# EAGLE schematic EXCISS SEU (EAGLE 7.7.0)
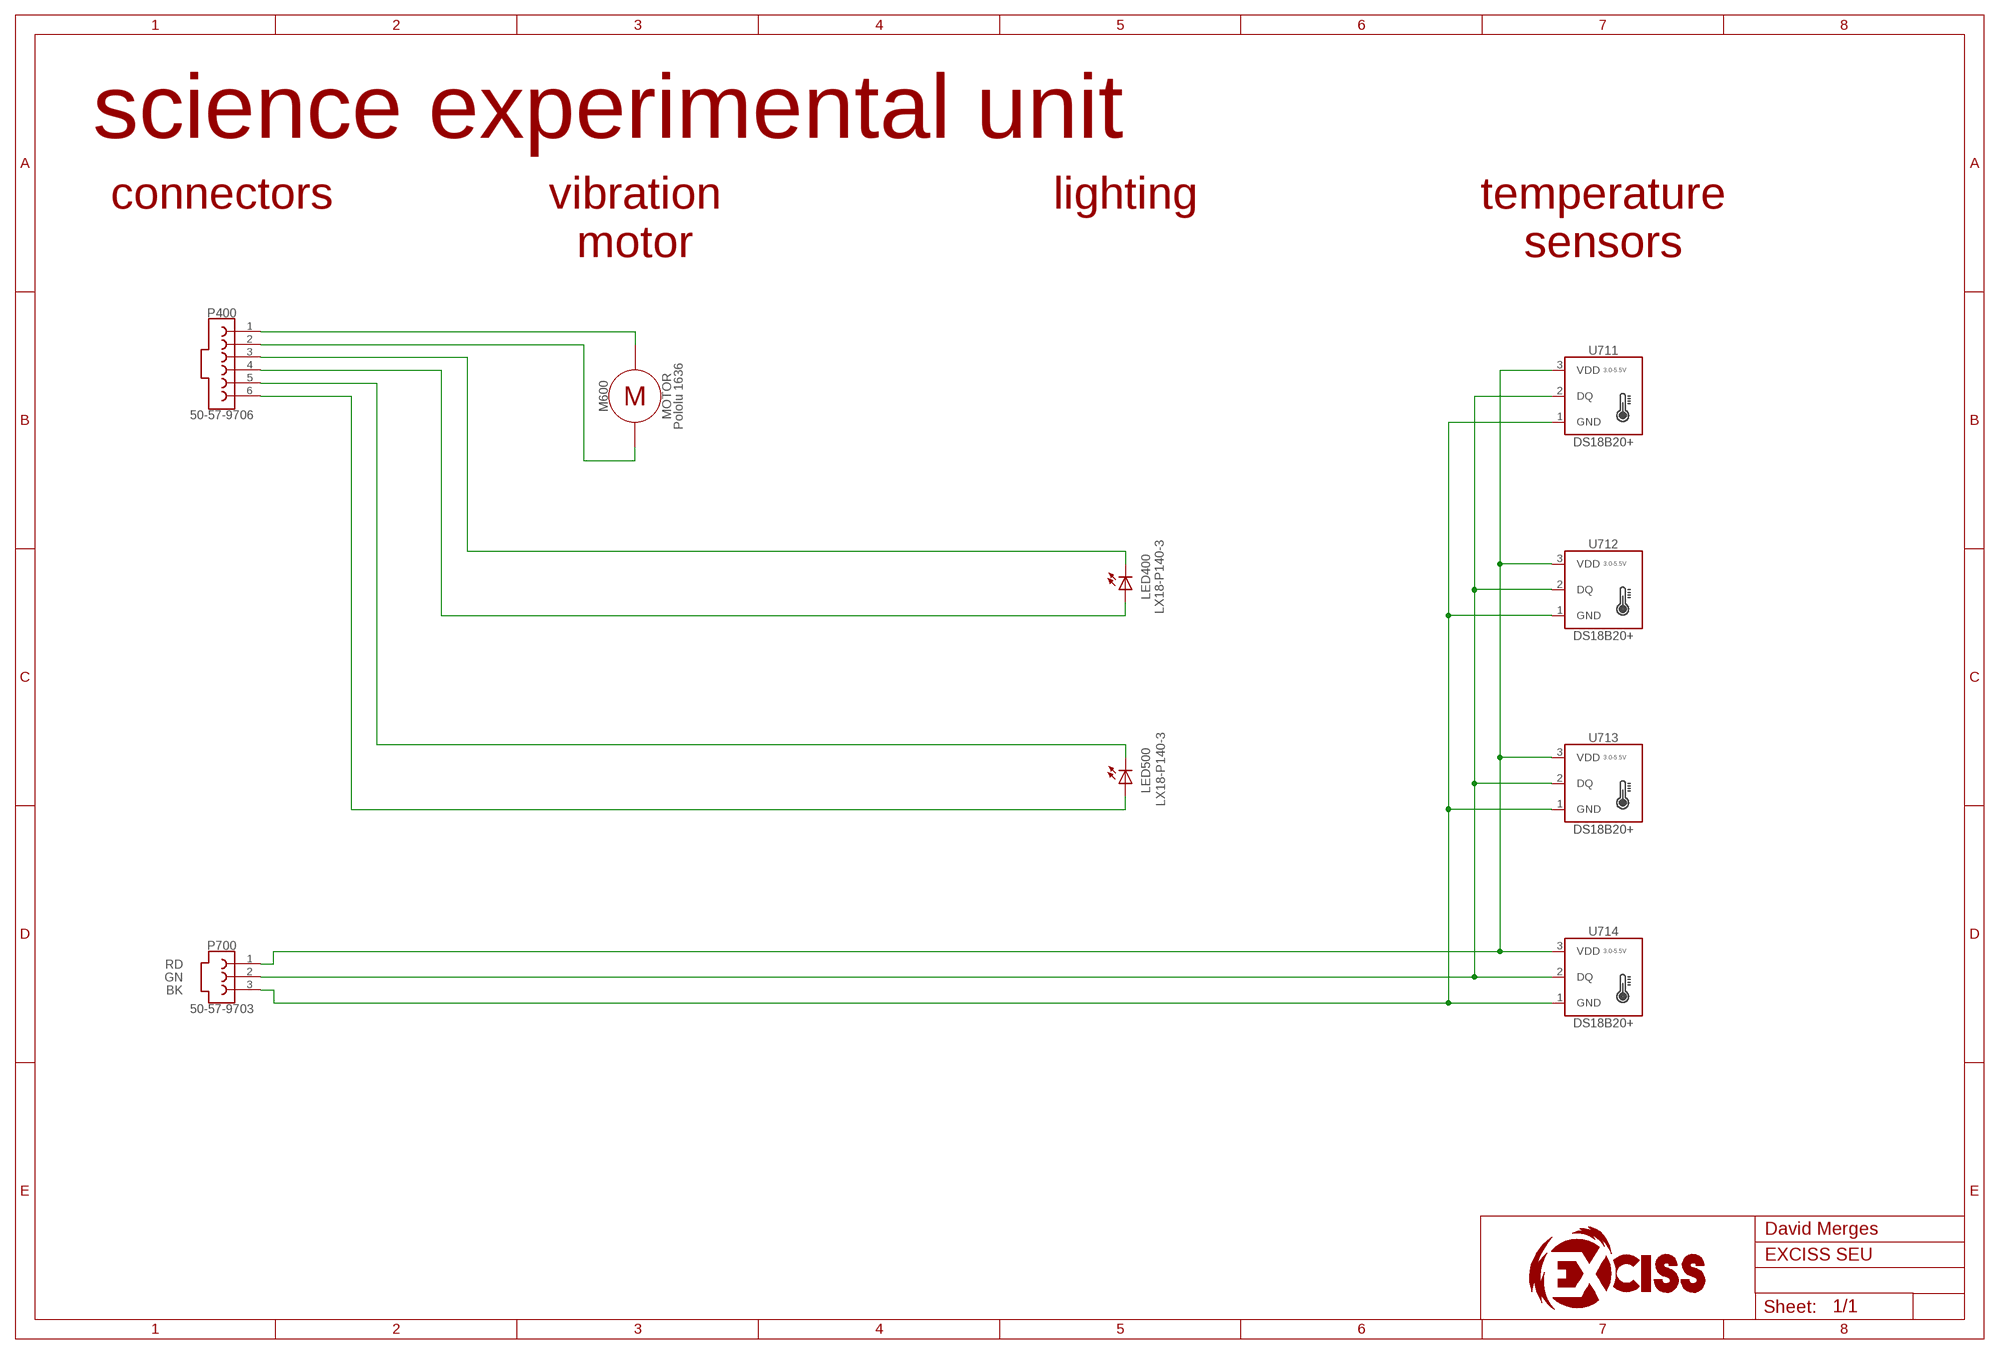
[diagram p0: schematic, sheet 1]

## Parts
LED400  LX18-P140-3  LED3MM  [LED3MM]
LED500  LX18-P140-3  LED3MM  [LED3MM]
M600  MOTOR  [DUMMY]
P400  50-57-9706  14-56-2064  [DUMMY]
P700  50-57-9703  14-56-2034  [DUMMY]
U711  DS18B20+  [TO-92-STRAIGHT]
U712  DS18B20+  [TO-92-STRAIGHT]
U713  DS18B20+  [TO-92-STRAIGHT]
U714  DS18B20+  [TO-92-STRAIGHT]

## Nets
N$4: M600.1 P400.1
N$5: M600.2 P400.2
N$6: LED400.K(C) P400.3
N$7: LED400.A P400.4
N$8: LED500.A P400.6
N$9: LED500.K(C) P400.5
N$10: P700.3 U711.1(GND) U712.1(GND) U713.1(GND) U714.1(GND)
N$11: P700.2 U711.2(DQ) U712.2(DQ) U713.2(DQ) U714.2(DQ)
N$12: P700.1 U711.3(VDD) U712.3(VDD) U713.3(VDD) U714.3(VDD)

## Notes on the sheet
- science experimental unit
- connectors
- vibration
  motor
- lighting
- temperature
  sensors
- Pololu 1636
- RD
- GN
- BK

## Library data of the parts
LED400 LED500 = adafruit:LED: LED OSRAM: - CHIPLED LG R971, LG N971, LY N971, LG Q971, LY Q971, LO R971, LY R971 LH N974, LH R974 LS Q976, LO Q976, LY Q976 LO Q996 - Hyper CHIPLED LW Q18S LB Q993, LB Q99A, LB R99A - SideLED LS A670, LO A670, LY A670, LG A670, LP A670 LB A673, LV A673, LT A673, LW A673 LH A674 LY A675 LS A676, LA A676, LO A676, LY A676, LW A676 LS A679, LY A679, LG A679 - Hyper Micro SIDELED® LS Y876, LA Y876, LO Y876, LY Y876 LT Y87S - SmartLED LW L88C, LW L88S LB L89C, LB L89S, LG L890 LS L89K, LO L89K, LY L89K LS L896, LA L896, LO L896, LY L896 - TOPLED LS T670, LO T670, LY T670, LG T670, LP T670 LSG T670, LSP T670, LSY T670, LOP T670, LYG T670 LG T671, LOG T671, LSG T671 LB T673, LV T673, LT T673, LW T673 LH T674 LS T676, LA T676, LO T676, LY T676, LB T676, LH T676, LSB T676, LW T676 LB T67C, LV T67C, LT T67C, LS T67K, LO T67K, LY T67K, LW E67C LS E67B, LA E67B, LO E67B, LY E67B, LB E67C, LV E67C, LT E67C LW T67C LS T679, LY T679, LG T679 LS T770, LO T770, LY T770, LG T770, LP T770 LB T773, LV T773, LT T773, LW T773 LH T774 LS E675, LA E675, LY E675, LS T675 LS T776, LA T776, LO T776, LY T776, LB T776 LHGB T686 LT T68C, LB T68C - Hyper Mini TOPLED® LB M676 - Mini TOPLED Santana® LG M470 LS M47K, LO M47K, LY M47K Source: http://www.osram.convergy.de/
M600 = exciss:MOTOR
P400 = exciss:14-56-2064: 14-56-2064 2.54mm Pitch SL Insulation Displacement Connector Assembly, Female, Single Row, Version G, Positive Lock, Wire Size 26 AWG, 0.38µm Gold (Au), 6 Circuits Links Datasheet <http://www.molex.com/webdocs/datasheets/pdf/en-us//0014562064_RB_CBL_WR_TRP_CONN.pdf> Product website <http://www.molex.com/molex/products/datasheet.jsp?part=active/0014562064_RB_CBL_WR_TRP_CONN.xml>
P700 = exciss:14-56-2034: 14-56-2034 2.54mm Pitch SL Insulation Displacement Connector Assembly, Female, Single Row, Version G, Positive Lock, Wire Size 26 AWG, 0.38µm Gold (Au), 3 Circuits Links Datasheet <http://www.molex.com/webdocs/datasheets/pdf/en-us//0014562034_RB_CBL_WR_TRP_CONN.pdf> Product website <http://www.molex.com/molex/products/datasheet.jsp?part=active/0014562034_RB_CBL_WR_TRP_CONN.xml>
U711-U714 = exciss:DS18B20: DS18B20 Programmable Resolution 1-Wire Digital Thermometer Links Datasheet <https://datasheets.maximintegrated.com/en/ds/DS18B20.pdf> Product website <https://www.maximintegrated.com/en/products/analog/sensors-and-sensor-interface/DS18B20.html>; OC_MOUSER: 700-DS18B20+